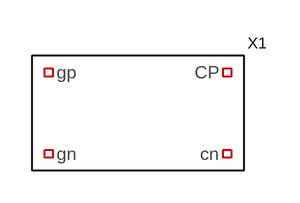
[diagram p0: schematic Draft3.asc]
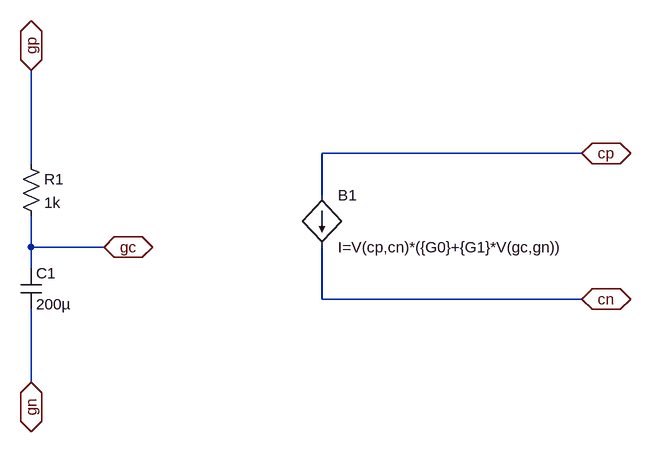
[diagram p1: sub-circuit new_symbol.asc]
Draft3.asc, the LTspice schematic file:
Version 4
SHEET 1 880 680
SYMBOL New_Symbol 80 176 R0
SYMATTR InstName X1

new_symbol.asc, the sub-circuit schematic file:
Version 4
SHEET 1 880 680
WIRE 464 64 64 64
WIRE -384 80 -384 -64
WIRE 64 128 64 64
WIRE -384 208 -384 160
WIRE -272 208 -384 208
WIRE -384 240 -384 208
WIRE 64 288 64 208
WIRE 464 288 64 288
WIRE -384 416 -384 304
FLAG 464 64 cp
IOPIN 464 64 BiDir
FLAG 464 288 cn
IOPIN 464 288 BiDir
FLAG -384 -64 gp
IOPIN -384 -64 BiDir
FLAG -272 208 gc
IOPIN -272 208 BiDir
FLAG -384 416 gn
IOPIN -384 416 BiDir
SYMBOL bi 64 128 R0
SYMATTR InstName B1
SYMATTR Value I=V(cp,cn)*({G0}+{G1}*V(gc,gn))
SYMBOL res -400 64 R0
SYMATTR InstName R1
SYMATTR Value 1k
SYMBOL cap -400 240 R0
SYMATTR InstName C1
SYMATTR Value 200µ

The netlist it stands for:
* Draft3.asc
XX1 NC_01 NC_02 NC_03 NC_04 new_symbol

* block symbol definitions
.subckt new_symbol CP cn gp gn
B1 cp cn I=V(cp,cn)*({G0}+{G1}*V(gc,gn))
R1 gp gc 1k
C1 gc gn 200µ
.ends new_symbol

.backanno
.end